# Altium schematic sheet Power - Copie.SchDoc: Init Title in DocParam
size A4; Organization: Use Organization_Name in ProjParam; Address1: Daniel Burnier; Address2: STI-IMT-LSRO1; Address3: EPFL; Address4: CH-1015 LAUSANNE; DocumentNumber: Init DocumentNumber in DocParam; Revision: A; SheetNumber: 1; SheetTotal: 1; ApprovedBy: Init ApprovedBy in DocParam; CheckedBy: Init CheckedBy in DocParam; Author: Init Author in DocParam; CompanyName: Init CompanyName in DocParam; DrawnBy: Init DrawBy in DocParam; Engineer: Init Engineer in DocParam; Title2: Init Title2 in DocParam; DocumentName: Init DocumentName in DocParam; ProjectName: Init ProjectName in DocParam
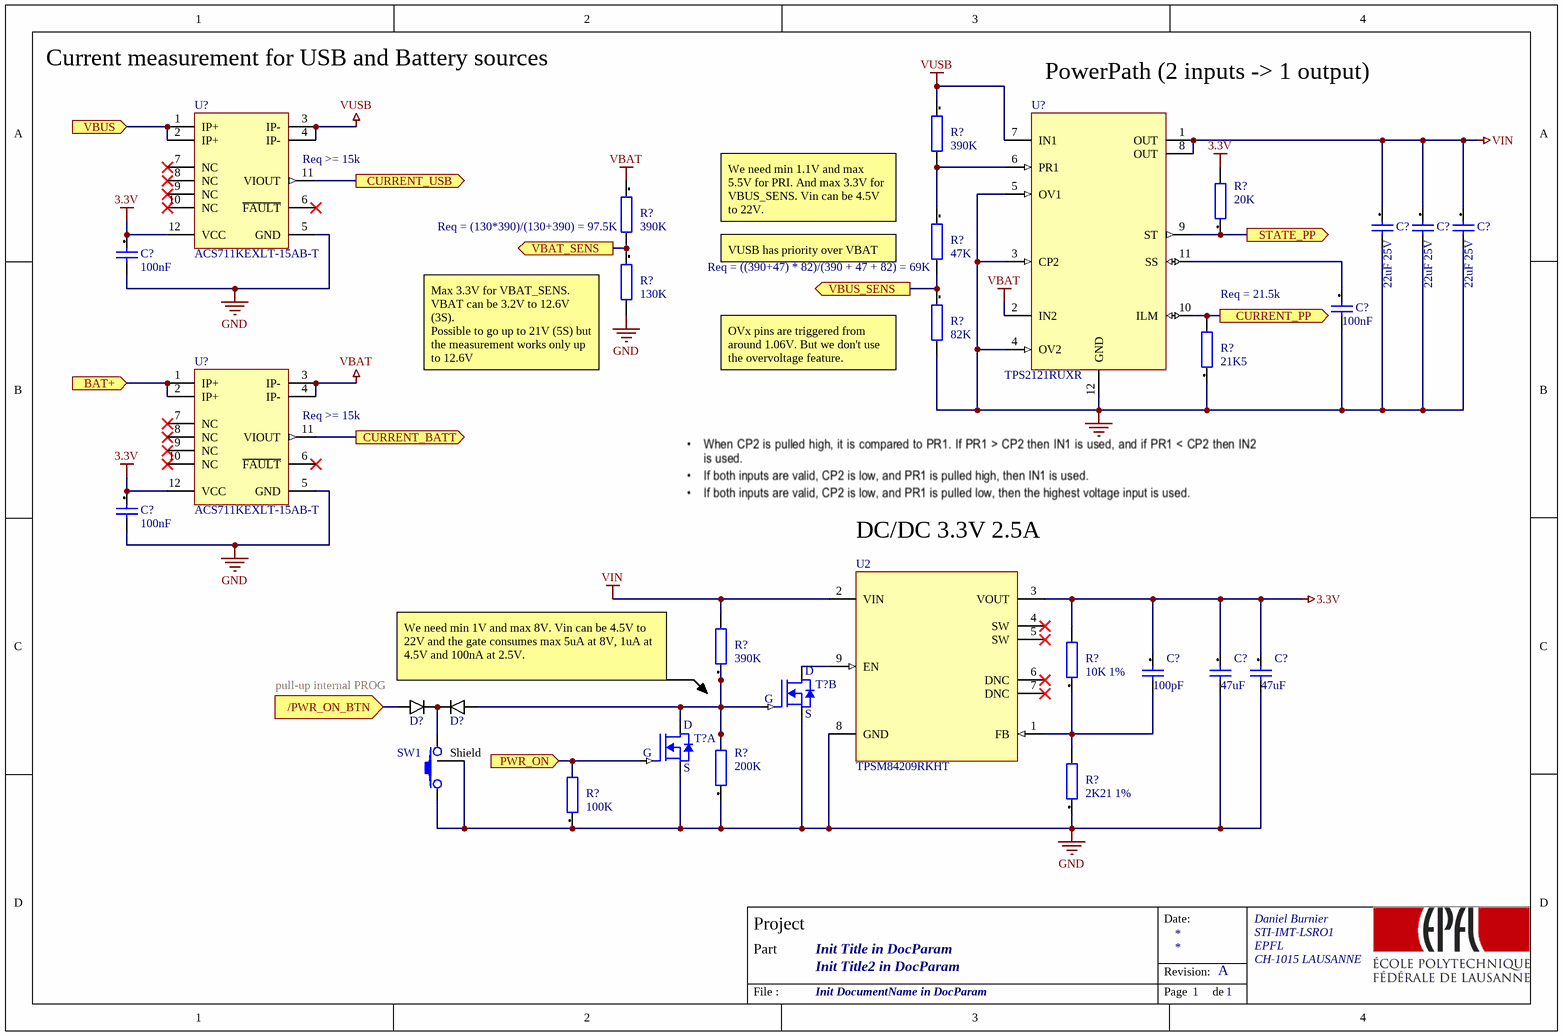
[diagram p0: Power - Copie.SchDoc]

## Parts
(Parts that share a designator on the sheet are numbered #1, #2 ... from top to bottom, then left to right.)
C?#1  22uF 25V  [CAPC2012X13L]
C?#2  22uF 25V  [CAPC2012X13L]
C?#3  22uF 25V  [CAPC2012X13L]
C?#4  100nF  [CAPC0201(0603)33_L]
C?#5  100nF  [CAPC0201(0603)33_L]
C?#6  100nF  [CAPC0201(0603)33_L]
C?#7  100pF  [CAPC0201(0603)33_L]
C?#8  47uF  [CAPC1608X08L]
C?#9  47uF  [CAPC1608X08L]
D?#1  RB751S-40DP-TP  [0201 diode]  (value not drawn)
D?#2  RB751S-40DP-TP  [0201 diode]  (value not drawn)
R?#1  390K  [RESC0201(0603)_L]
R?#2  390K  [RESC0201(0603)_L]
R?#3  47K  [RESC0201(0603)_L]
R?#4  20K  [RESC0201(0603)_L]
R?#5  130K  [RESC0201(0603)_L]
R?#6  82K  [RESC0201(0603)_L]
R?#7  21K5  [RESC0201(0603)_L]
R?#8  390K  [RESC0201(0603)_L]
R?#9  10K 1%  [RESC0201(0603)_L]
R?#10  200K  [RESC0201(0603)_L]
R?#11  2K21 1%  [RESC0201(0603)_L]
R?#12  100K  [RESC0201(0603)_L]
SW1  button  [C&K_KMR2]  (value not drawn)
T?#1  PMDXB550UNEZ  [DFN1010B-6]  (value not drawn)  (part B of 2)
T?#2  PMDXB550UNEZ  [DFN1010B-6]  (value not drawn)  (part A of 2)
U2  TPSM84209RKHT  [QFN-FCMOD (RKH) 9]
U?#1  ACS711KEXLT-15AB-T  [12-PowerWFQFN]
U?#2  TPS2121RUXR  [VQFN-HR (RUX) 12]
U?#3  ACS711KEXLT-15AB-T  [12-PowerWFQFN]

## Ports
/PWR_ON_BTN (in), BAT+ (in), CURRENT_BATT (out), CURRENT_PP (out), CURRENT_USB (out), PWR_ON (in), STATE_PP (out), VBAT_SENS (out), VBUS (in), VBUS_SENS (out)

## Nets
3.3V: C?#4.1 C?#6.1 C?#7.1 C?#8.1 C?#9.1 R?#4.2 R?#9.2 U2.3(VOUT) U?#1.12(VCC) U?#3.12(VCC)
GND: C?#1.2 C?#2.2 C?#3.2 C?#4.2 C?#5.2 C?#6.2 C?#8.2 C?#9.2 R?#5.2 R?#6.2 R?#7.1 R?#10.1 R?#11.1 R?#12.1 SW1.1 SW1.Shield T?#1.4(S) T?#2.1(S) U2.8(GND) U?#1.5(GND) U?#2.3(CP2) U?#2.4(OV2) U?#2.5(OV1) U?#2.12(GND) U?#3.5(GND)
VBAT: R?#2.1 U?#2.2(IN2) U?#3.3(IP-) U?#3.4(IP-)
VIN: C?#1.1 C?#2.1 C?#3.1 R?#8.2 U2.2(VIN) U?#2.1(OUT) U?#2.8(OUT)
VUSB: R?#1.1 U?#1.3(IP-) U?#1.4(IP-) U?#2.7(IN1)
/PWR_ON_BTN: D?#1.1 ; port /PWR_ON_BTN
BAT+: U?#3.1(IP+) U?#3.2(IP+) ; port BAT+
CURRENT_BATT: U?#3.11(VIOUT) ; port CURRENT_BATT
CURRENT_PP: R?#7.2 U?#2.10(ILM) ; port CURRENT_PP
CURRENT_USB: U?#1.11(VIOUT) ; port CURRENT_USB
PWR_ON: R?#12.2 T?#2.2(G) ; port PWR_ON
STATE_PP: R?#4.1 U?#2.9(ST) ; port STATE_PP
VBAT_SENS: R?#2.2 R?#5.1 ; port VBAT_SENS
VBUS: U?#1.1(IP+) U?#1.2(IP+) ; port VBUS
VBUS_SENS: R?#3.2 R?#6.1 ; port VBUS_SENS
NetC?#5_1: C?#5.1 U?#2.11(SS)
NetC?#7_2: C?#7.2 R?#9.1 R?#11.2 U2.1(FB)
NetD?#1_0: D?#1.0 D?#2.0 SW1.2
NetD?#2_1: D?#2.1 R?#8.1 R?#10.2 T?#1.5(G) T?#2.6(D)
NetR?#1_2: R?#1.2 R?#3.1 U?#2.6(PR1)
NetT?#1_3: T?#1.3(D) U2.9(EN)

Not connected (* = marked no-connect by the designer): U2 4(SW)* 5(SW)* 6(DNC)* 7(DNC)*; U?#1 6(~{FAULT})* 7(NC)* 8(NC)* 9(NC)* 10(NC)*; U?#3 6(~{FAULT})* 7(NC)* 8(NC)* 9(NC)* 10(NC)*

## Notes on the sheet
- Current measurement for USB and Battery sources
- PowerPath (2 inputs -> 1 output)
- (near U?#1) Req >= 15k
- (near R?#2) Req = (130*390)/(130+390) = 97.5K
- (near R?#1) We need min 1.1V and max 5.5V for PRI. And max 3.3V for VBUS_SENS. Vin can be 4.5V to 22V.
- (near R?#3) Req = ((390+47) * 82)/(390 + 47 + 82) = 69K
- (near R?#3) VUSB has priority over VBAT
- (near R?#7) Req = 21.5k
- (near R?#5) Max 3.3V for VBAT_SENS. VBAT can be 3.2V to 12.6V (3S).
  Possible to go up to 21V (5S) but the measurement works only up to 12.6V
- (near R?#6) OVx pins are triggered from around 1.06V. But we don't use the overvoltage feature.
- (near U?#3) Req >= 15k
- DC/DC 3.3V 2.5A
- (near D?#1) pull-up internal PROG
- (near D?#2) We need min 1V and max 8V. Vin can be 4.5V to 22V and the gate consumes max 5uA at 8V, 1uA at 4.5V and 100nA at 2.5V.
- Date:
- Project
- Part
- Revision:
- File :
- Page
- de

## Library data of the parts
C?#1-C?#3 = TBD Capacitor[[/\]]0805[[/\]]1: Capacitor TBD 0805; Preference: 1; Currentie: CHF; Size: 0805; Footprint Acort: 0805_G; ROHS: True; DateLastUpdate: 2012-11-19 / 14:37:26
C?#4-C?#7 = TBD Capacitor[[/\]]0201[[/\]]1: Capacitor TBD 0201; Preference: 1; Currentie: CHF; Size: 0201; Footprint Acort: 0201; ROHS: True; DateLastUpdate: 2018-10-19 / 8:59:52 AM
C?#8 C?#9 = TBD Capacitor[[/\]]0603[[/\]]1: Capacitor TBD 0603; Preference: 1; Currentie: CHF; Size: 0603; Footprint Acort: 0603_G; ROHS: True; DateLastUpdate: 2012-11-19 / 14:36:40
D?#1 D?#2 = RB751S-40DP-TP: Schottky Diodes & Rectifiers 203 Package Schottky Diodes; Manufacturer: MCC; Reverse Voltage (DC): 28V; Average Rectified Current: 30mA; Element Configuration: Single; Forward Current: 200mA; Max Repetitive Reverse Voltage (Vrrm): 40V; Peak Reverse Current: 500nA; Max Power Dissipation: 100mW; Supplier 1: Digi-Key; Manufacturer Part Number: RB751S-40DP-TP; Stock 1: 104704; Pricing 1: 1=0.3, 10=0.27, 100=0.1514, 500=0.08112, 1000=0.05516 (USD); Mount: Surface Mount; Case/Package: 0201; Case Code (Metric): 0603; Case Code (Imperial): 0201; Max Operating Temperature: 125°C; Packaging: Tape and Reel; Termination: SMD/SMT; Max Forward Surge Current (Ifsm): 200mA; Package Quantity: 10000; Max Reverse Voltage (DC): 40V; Length: 0.67mm; Height: 0.34mm; Width: 0.37mm; Supplier Part Number 1: RB751S-40DP-TPMSCT-ND
R?#1-R?#12 = TBD[[/\]]0201[[/\]]1: Resistor ToDo 0201; Preference: 1; Currentie: CHF; Size: 0201; Footprint Acort: 0201; ROHS: True; DateLastUpdate: 2018-10-19 / 9:06:49 AM
SW1 = C&K KMR2: KMR221GLFS; Manufacturer: Tyco; Manufacturer Nr: 7-188275-6; Preference: 1; Currentie: CHF; Quant_1: 10; Quant_2: 900; Circuit: SPST-NO; Switch Function: Off-Mom; Contact Rating @ Voltage: 0.05A @ 32VDC; Actuator Type: Standard; Actuator Height off PCB, from Pins: 1.90mm; Actuator Orientation: Top Actuated; Outline: 4.60mm x 2.80mm; Illumination: Non-Illuminated; Operating Force: 200gf; Switch Travel: 0.25mm; Mechanical Life: 200,000 Cycles; Footprint Acort: ToDefine; ComponentLink1Description: Datasheet; ComponentLink1URL: http://ecommas.tycoelectronics.com/commerce/DocumentDelivery/DDEController?Action=showdoc&DocId=Customer+Drawing%7F188275%7FR%7Fpdf%7FEnglish%7FC_188275_R.pdf; Supplier: Farnell; Supplier Nr: 1056234; ComponentLink2Description: Farnell link; ComponentLink2URL: http://fr.farnell.com/jsp/displayProduct.jsp?sku=1056234; ROHS: True; Type: SMD; Orientation: Vertical; DateLastUpdate: 2007-12-04 / 09:15:57; Price_1: 1,1; Price_2: 0,924; Supplier 1: Digi-Key; Manufacturer Part Number: KMR221GLFS; Category: Switches; Stock 1: 20549; Pricing 1: 1=0.51, 10=0.493, 25=0.484, 50=0.4656, 100=0.4017, 250=0.3652, 500=0.34694, 1000=0.2739 (USD); Packaging: Cut Tape (CT); Mounting Type: Surface Mount; Termination Style: Gull Wing; Illumination Voltage (Nominal): -; Illumination Type, Color: -; Ingress Protection: -; Features: Grounding Pin; Actuator Material: -; Operating Temperature: -40°C ~ 85°C; ComponentLink3URL: http://www.ck-components.com/index.php?module=media&action=Display&cmpref=14414&lang=en&width=&height=&format=&alt=; ComponentLink3Description: http://www.ck-components.com/index.php?module=media&action=Display&cmpref=14414&lang=en&width=&height=&format=&alt=; Supplier Part Number 1: 401-1427-1-ND
T?#1 T?#2 = PMDXB550UNEZ: DUAL N-CHANNEL 30V; Manufacturer: NXP Semiconductors; Continuous Drain Current (ID): 590mA; Max Power Dissipation: 285mW; Rds On Max: 670mR; Input Capacitance: 30.3pF; FET Type: 2 N-Channel; Supplier 1: Digi-Key; Stock 1: 5582; Pricing 1: 1=0.48, 10=0.379, 100=0.2601, 500=0.17838, 1000=0.13379 (USD); Mount: Surface Mount; Min Operating Temperature: -55°C; Max Operating Temperature: 150°C; Drain to Source Voltage (Vdss): 30V; Packaging: Tape and Reel; Supplier Part Number 1: 1727-2277-1-ND; Manufacturer Part Number: PMDXB550UNEZ
U2 = TPSM84209RKHT: DC DC CONVERTER 1.2-6V 15W; Manufacturer: Texas Instruments; Voltage - Input (Min): 4.5V; Voltage - Input (Max): 28V; Voltage - Output 1: 1.2 ~ 6 V; Current - Output (Max): 2.5A; Efficiency: 86.5%; Supplier 1: Digi-Key; Manufacturer Part Number: TPSM84209RKHT; RoHS: Request Inventory Verification; Category: Power Supplies - Board Mount; Stock 1: 47; Pricing 1: 1=5.04, 10=4.53, 100=3.7117 (USD); Packaging: Cut Tape (CT); Part Status: Active; Type: Non-Isolated PoL Module; Voltage - Output 2: -; Voltage - Output 3: -; Voltage - Output 4: -; Applications: ITE (Commercial); Features: OCP, OTP, UVLO; Operating Temperature: -40°C ~ 85°C (With Derating); Mounting Type: Surface Mount; Package / Case: 9-PowerQFN; Size / Dimension: 0.18" L x 0.16" W x 0.08" H (4.5mm x 4.0mm x 2.1mm); Supplier Device Package: 9-QFN-FCMOD (4.5x4); ComponentLink1URL: http://www.ti.com/lit/ds/symlink/tpsm84209.pdf; ComponentLink1Description: http://www.ti.com/lit/ds/symlink/tpsm84209.pdf
U?#1 U?#3 = ACS711KEXLT-15AB-T: Hall Effect Linear Current Sensor with Overcurrent Fault Output for <100 V Isolation Applications, 3 to 5.5 V, -15.5 to 15.5 A IP, -40 to 125 degC, 12-Pin QFN (EX), RoHS, Tape and Reel; VCC Max: 5.5 V; IP Max: 15.5 A; VCC Min: 3 V; IP Min: -15.5 A; -3dB Bandwidth: 0.1 MHz; PackageDescription: 12-Pin Quad Flat No-Lead, Body 3 x 3 mm, Height 0.8 mm; ComponentLink1URL: http://www.allegromicro.com/; Packing: Tape and Reel; ComponentLink2URL: http://www.allegromicro.com/~/media/Files/Datasheets/ACS711-Datasheet.ashx?la=en; DatasheetVersion: Rev. 3; PartNumber: ACS711KEXLT-15AB-T; ComponentLink2Description: Datasheet; ComponentLink3URL: http://www.allegromicro.com/~/media/Files/Datasheets/ACS711-Datasheet.ashx?la=en; RoHS: TRUE; ComponentLink1Description: Manufacturer URL; ComponentLink3Description: Package Specification; Temperature Max: 125 degC; Mounting Technology: Surface Mount; Temperature Min: -40 degC
U?#2 = TPS2121RUXR: Power Mux Dual Input One Output; Manufacturer: Texas Instruments; PartNumber: TPS2121RUXR; RefDes: RefDes; Type: DEV; Value: Value